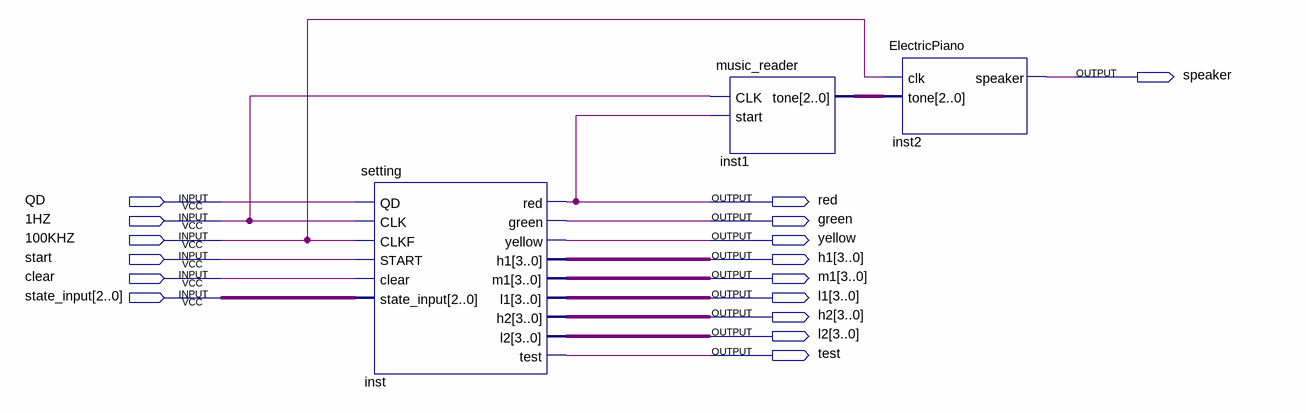
[diagram p0: schematic sheet]
// Quartus schematic pill_music.bdf as structural Verilog: 3 symbols, 16 pins
module pill_music (
  input  QD,
  input  \1HZ ,
  input  \100KHZ ,
  input  start,
  input  clear,
  input  [2:0] state_input,
  output speaker,
  output red,
  output green,
  output yellow,
  output [3:0] h1,
  output [3:0] m1,
  output [3:0] l1,
  output [3:0] h2,
  output [3:0] l2,
  output test
);

  wire [2:0] inst1_tone;

  setting inst (
    .QD(QD), .CLK(\1HZ ), .CLKF(\100KHZ ), .START(start), .clear(clear), .state_input(state_input),
    .red(red), .green(green), .yellow(yellow), .h1(h1), .m1(m1), .l1(l1), .h2(h2), .l2(l2), .test(test));
  music_reader inst1 (.CLK(\1HZ ), .start(red), .tone(inst1_tone));
  ElectricPiano inst2 (.clk(\100KHZ ), .tone(inst1_tone), .speaker(speaker));
endmodule
